# Altium schematic sheet AD9244.SchDoc
size A4
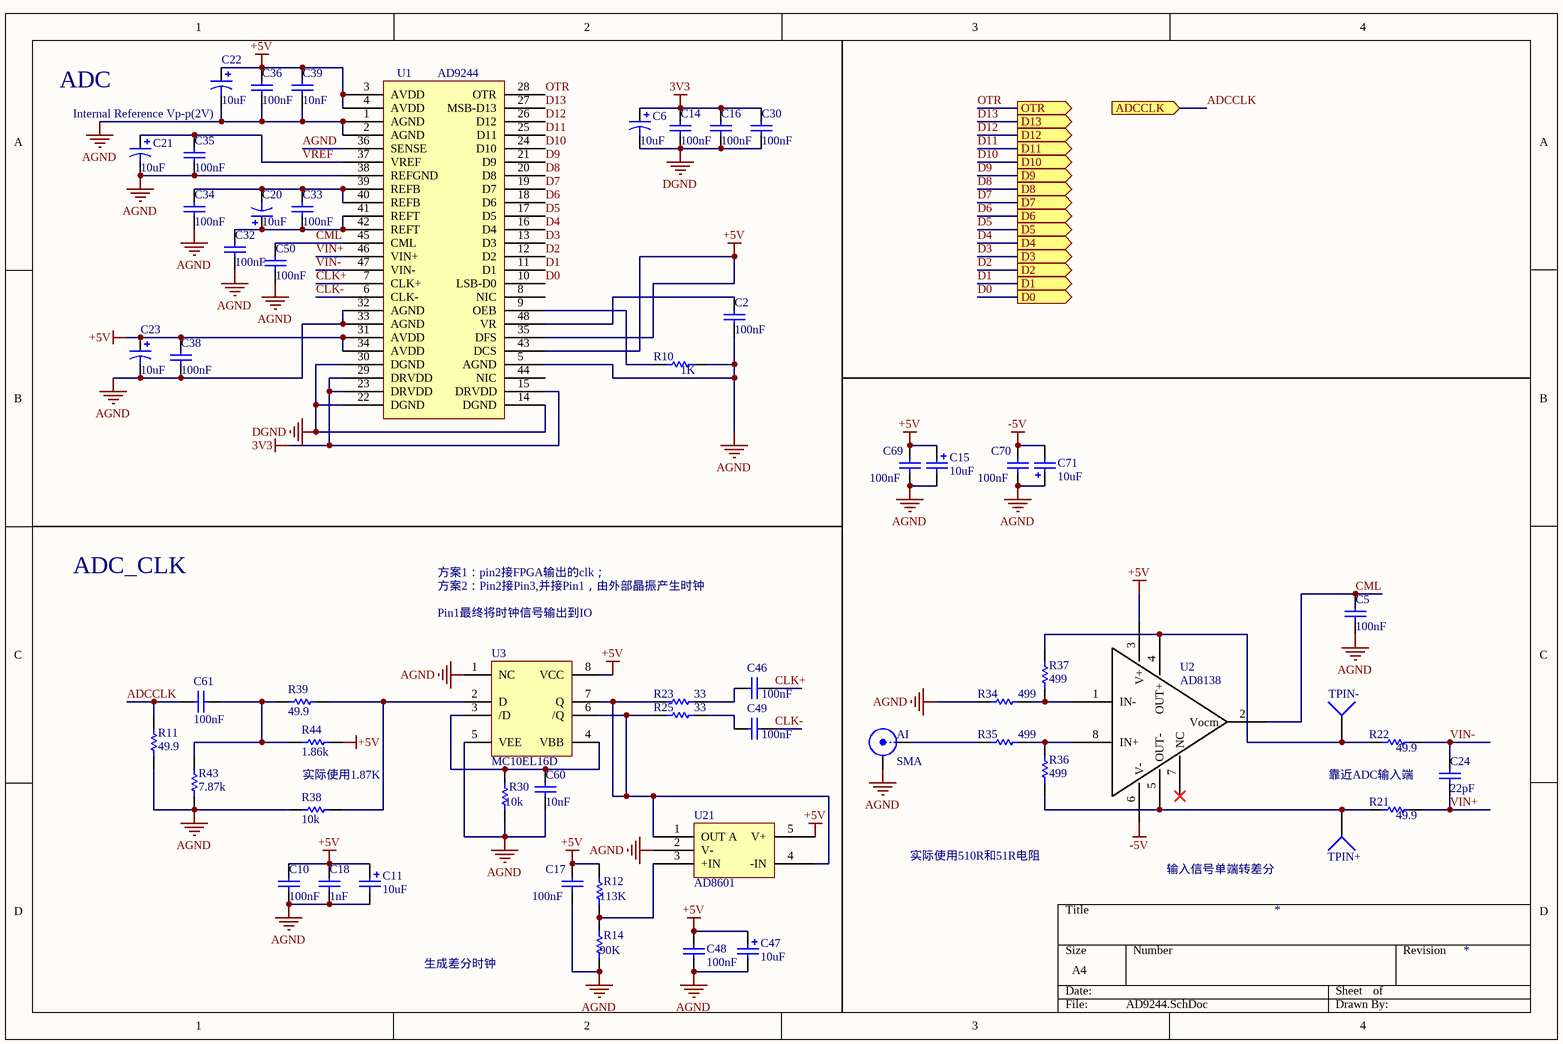
[diagram p0: AD9244.SchDoc]

## Parts
AI  SMA  [SMA_SMT]
C2  100nF  [0603]
C5  100nF  [0603]
C6  value 10uF  [1206]  (hidden comment: 10uF_pol)
C10  100nF  [0603]
C11  10uF  [3216]
C14  100nF  [0603]
C15  10uF  [3216]
C16  100nF  [0603]
C17  100nF  [0603]
C18  1nF  [0603]
C20  value 10uF  [1206]  (hidden comment: 10uF_pol)
C21  value 10uF  [1206]  (hidden comment: 10uF_pol)
C22  value 10uF  [1206]  (hidden comment: 10uF_pol)
C23  value 10uF  [1206]  (hidden comment: 10uF_pol)
C24  22pF  [0603]
C30  100nF  [0603]
C32  100nF  [0603]
C33  100nF  [0603]
C34  100nF  [0603]
C35  100nF  [0603]
C36  100nF  [0603]
C38  100nF  [0603]
C39  value 10nF  [0603]  (hidden comment: 100nF)
C46  100nF  [0603]
C47  10uF  [3216]
C48  100nF  [0603]
C49  100nF  [0603]
C50  100nF  [0603]
C60  10nF  [0603]
C61  100nF  [0603]
C69  100nF  [0603]
C70  100nF  [0603]
C71  10uF  [3216]
R10  1k  [0603]
R11  49.9  [0603]
R12  113K  [0603]
R14  90K  [0603]
R21  49.9  [0603]
R22  49.9  [0603]
R23  33  [0603]
R25  33  [0603]
R30  10k  [0603]
R34  499  [0603]
R35  499  [0603]
R36  499  [0603]
R37  499  [0603]
R38  10k  [0603]
R39  value 49.9  [0603]  (hidden comment: 49。9)
R43  7.87k  [0603]
R44  1.86k  [0603]
TPIN+  TPIN+  [PIN1]  (value not drawn)
TPIN-  TPIN-  [PIN1]  (value not drawn)
U1  AD9244
U2  AD8138  [SO-8N]
U3  MC10EL16D  [SO-8]
U21  AD8601  [SOT23-5]

## Ports
ADCCLK (in), D0 (out), D1 (out), D2 (out), D3 (out), D4 (out), D5 (out), D6 (out), D7 (out), D8 (out), D9 (out), D10 (out), D11 (out), D12 (out), D13 (out), OTR (out)

## Nets
3V3: C6.1 C14.1 C16.1 C30.1 U1.15(DRVDD) U1.23(DRVDD) U1.29(DRVDD)
+5V: C10.1 C11.1 C15.1 C17.1 C18.1 C22.1 C23.1 C36.1 C38.1 C39.1 C47.1 C48.2 C69.2 R12.1 R44.1 U1.3(AVDD) U1.4(AVDD) U1.31(AVDD) U1.34(AVDD) U1.35(DFS) U1.43(DCS) U2.3(V+) U3.8(VCC) U21.5(V+)
-5V: C70.2 C71.2 U2.6(V-)
AGND: AI.2(Y) C2.2 C5.2 C10.2 C11.2 C15.2 C17.2 C18.2 C21.2 C22.2 C23.2 C32.2 C34.2 C35.2 C36.2 C38.2 C39.2 C47.2 C48.1 C50.2 C60.2 C69.1 C70.1 C71.1 R10.1 R11.1 R14.2 R30.2 R34.1 R38.2 R43.1 U1.1(AGND) U1.2(AGND) U1.5(AGND) U1.32(AGND) U1.33(AGND) U1.36(SENSE) U1.38(REFGND) U3.1(NC) U3.5(VEE) U21.2(V-)
DGND: C6.2 C14.2 C16.2 C30.2 U1.14(DGND) U1.22(DGND) U1.30(DGND)
ADCCLK: C61.1 R11.2 ; port ADCCLK
CLK+: C46.2 U1.7(CLK+)
CLK-: C49.2 U1.6(CLK-)
CML: C5.1 C50.1 U1.45(CML) U2.2(Vocm)
D0: U1.10(LSB-D0) ; port D0
D1: U1.11(D1) ; port D1
D2: U1.12(D2) ; port D2
D3: U1.13(D3) ; port D3
D4: U1.16(D4) ; port D4
D5: U1.17(D5) ; port D5
D6: U1.18(D6) ; port D6
D7: U1.19(D7) ; port D7
D8: U1.20(D8) ; port D8
D9: U1.21(D9) ; port D9
D10: U1.24(D10) ; port D10
D11: U1.25(D11) ; port D11
D12: U1.26(D12) ; port D12
D13: U1.27(MSB-D13) ; port D13
OTR: U1.28(OTR) ; port OTR
VIN+: C24.2 R21.1 U1.46(VIN+)
VIN-: C24.1 R22.1 U1.47(VIN-)
VREF: C21.1 C35.1 U1.37(VREF)
NetAI_1: AI.1(X) R35.1
NetC2_1: C2.1 U1.48(VR)
NetC20_1: C20.1 C32.1 C33.2 U1.41(REFT) U1.42(REFT)
NetC20_2: C20.2 C33.1 C34.1 U1.39(REFB) U1.40(REFB)
NetC46_1: C46.1 R23.2
NetC49_1: C49.1 R25.2
NetC60_1: C60.1 R30.1 U3.3(/D) U3.4(VBB)
NetC61_2: C61.2 R39.2 R43.2 R44.2
NetR10_2: R10.2 U1.9(OEB)
NetR12_2: R12.2 R14.1 U21.3(+IN)
NetR21_2: R21.2 R36.1 TPIN+.1 U2.5(OUT-)
NetR22_2: R22.2 R37.2 TPIN-.1 U2.4(OUT+)
NetR23_1: R23.1 R25.1 U3.6(/Q) U3.7(Q) U21.1(OUT_A) U21.4(-IN)
NetR34_2: R34.2 R37.1 U2.1(IN-)
NetR35_2: R35.2 R36.2 U2.8(IN+)
NetR38_1: R38.1 R39.1 U3.2(D)

Not connected (* = marked no-connect by the designer): U1 8(NIC) 44(NIC); U2 7(NC)*

## Notes on the sheet
- ADC
- (near C22) Internal Reference Vp-p(2V)
- ADC_CLK
- 方案1：pin2接FPGA输出的clk；
- 方案2：Pin2接Pin3,并接Pin1，由外部晶振产生时钟
- Pin1最终将时钟信号输出到IO
- 实际使用1.87K
- 靠近ADC输入端
- 实际使用510R和51R电阻
- 输入信号单端转差分
- 生成差分时钟

## Library data of the parts
AI = BNC: BNC Elbow Connector; LatestRevisionDate: 17-Jul-2002; LatestRevisionNote: Re-released for DXP Platform.; Publisher: Altium Limited
C2 C5 C10 C14 C16-C18 C24 C30 C32-C36 C38 C39 C46 C48-C50 C60 C61 C69 C70 = Cap Semi: Capacitor (Semiconductor SIM Model); Published: 8-Jun-2000; LatestRevisionDate: 29-May-2009; LatestRevisionNote: IPC-7351 Footprint Added.; PackageReference: C1206; Publisher: Altium Limited; PackageDescription: Chip Capacitor
  C2 C5 C10 C14 C16 C17 C30 C32-C36 C38 C46 C48-C50 C61 C69 C70: Value: 100nF
  C18: Value: 1nF
  C24: Value: 22pF
  C60: Value: 10nF
C6 C20-C23 = Cap Pol3: Polarized Capacitor (Surface Mount); Published: 8-Jun-2000; LatestRevisionDate: 29-May-2009; LatestRevisionNote: IPC-7351 Footprint Added.; PackageReference: C0805; Publisher: Altium Limited; PackageDescription: Chip Capacitor
C11 C15 C47 C71 = Cap Pol2: Polarized Capacitor (Axial); Published: 8-Jun-2000; LatestRevisionDate: 17-Jul-2002; LatestRevisionNote: Re-released for DXP Platform.; PackageReference: POLAR0.8; Publisher: Altium Limited; Value: 10uF
R10 R11 R21 R22 R30 R38 R39 R43 R44 = Res1: Resistor; Published: 8-Jun-2000; LatestRevisionDate: 17-Jul-2002; LatestRevisionNote: Re-released for DXP Platform.; PackageReference: AXIAL-0.3; Publisher: Altium Limited
  R10: Value: 1K
  R11 R21 R22: Value: 49.9
  R30 R38: Value: 10k
  R43: Value: 7.87k
  R44: Value: 1.86k
R12 R14 R23 R25 R34-R37 = Res1: Resistor; Value: 10k; Published: 8-Jun-2000; LatestRevisionDate: 17-Jul-2002; LatestRevisionNote: Re-released for DXP Platform.; PackageReference: AXIAL-0.3; Publisher: Altium Limited
TPIN+ TPIN- = Socket: LatestRevisionDate: 17-Jul-2002; LatestRevisionNote: Re-released for DXP Platform.; Publisher: Altium Limited
U1 = DSx4
U21 = AD8601: Precision CMOS, Single Supply, Rail to Rail, Windband Operational Amplifiers